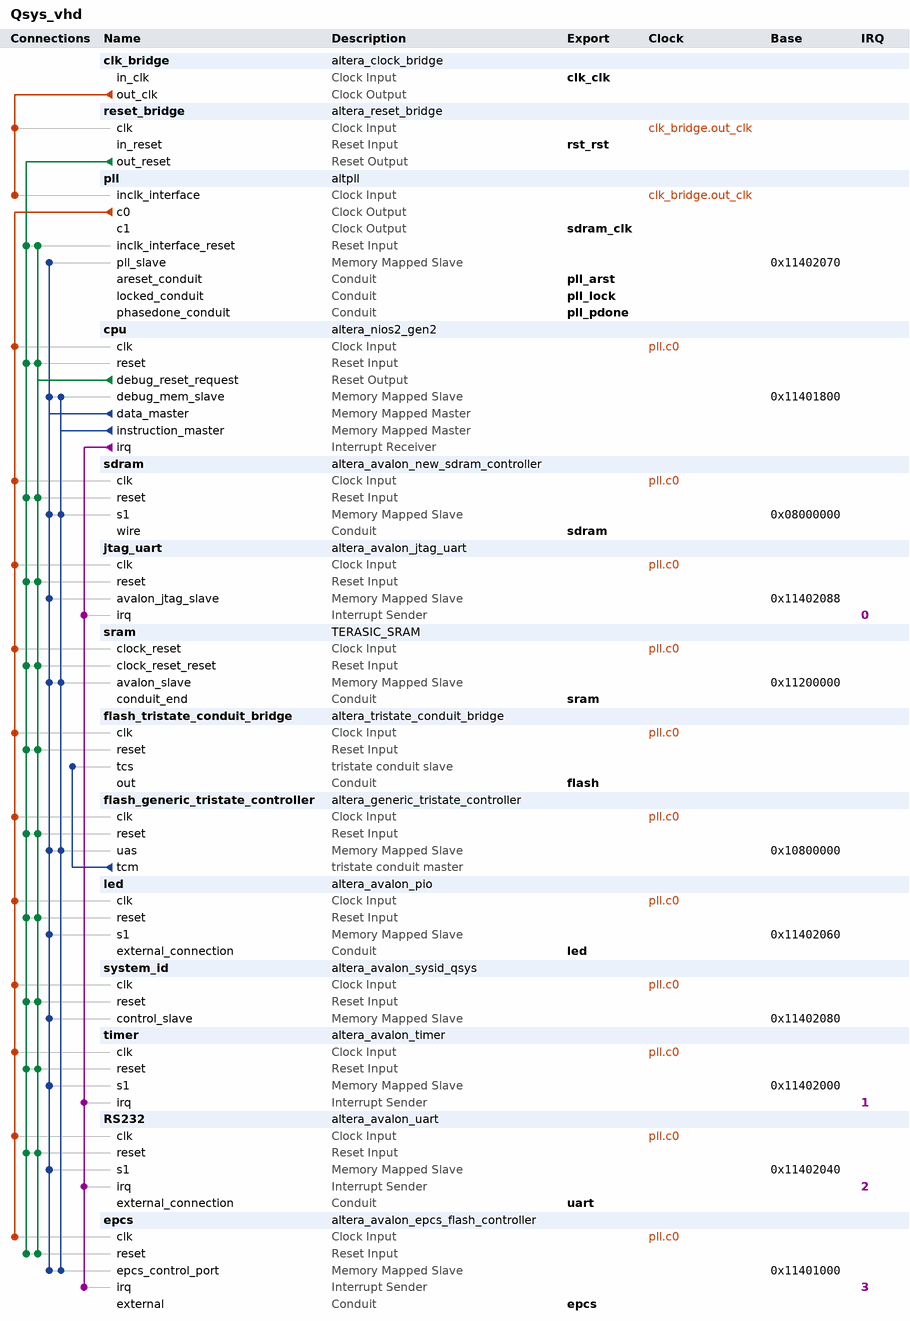
[diagram p0: system contents]
# Platform Designer (Qsys) system Qsys_vhd, Cyclone IV E EP4CE115F29C7
# Parameters at their usual value, and those the tool derives, are not listed.
package require -exact qsys 15.0
create_system Qsys_vhd
set_project_property DEVICE_FAMILY {Cyclone IV E}
set_project_property DEVICE EP4CE115F29C7

add_instance clk_bridge altera_clock_bridge 15.0
set_instance_parameter_value clk_bridge DERIVED_CLOCK_RATE 0
set_instance_parameter_value clk_bridge EXPLICIT_CLOCK_RATE 0

add_instance reset_bridge altera_reset_bridge 15.0
set_instance_parameter_value reset_bridge ACTIVE_LOW_RESET 1
set_instance_parameter_value reset_bridge SYNCHRONOUS_EDGES deassert

add_instance pll altpll 15.0
set_instance_parameter_value pll CLK0_DIVIDE_BY 1
set_instance_parameter_value pll CLK0_MULTIPLY_BY 2
set_instance_parameter_value pll CLK1_DIVIDE_BY 1
set_instance_parameter_value pll CLK1_DUTY_CYCLE 50
set_instance_parameter_value pll CLK1_MULTIPLY_BY 2
set_instance_parameter_value pll CLK1_PHASE_SHIFT -1806
set_instance_parameter_value pll CLK2_DIVIDE_BY 5
set_instance_parameter_value pll CLK2_DUTY_CYCLE 50
set_instance_parameter_value pll CLK2_MULTIPLY_BY 1
set_instance_parameter_value pll CLK2_PHASE_SHIFT 0
set_instance_parameter_value pll INCLK0_INPUT_FREQUENCY 20000
set_instance_parameter_value pll PORT_ARESET PORT_UNUSED
set_instance_parameter_value pll PORT_LOCKED PORT_UNUSED
set_instance_parameter_value pll PORT_clk1 PORT_USED
set_instance_parameter_value pll PORT_clk2 PORT_USED
set_instance_parameter_value pll PORT_clk3 PORT_UNUSED

add_instance cpu altera_nios2_gen2 15.0
set_instance_parameter_value cpu dcache_size 2048
set_instance_parameter_value cpu exceptionSlave sdram.s1
set_instance_parameter_value cpu icache_size 4096
set_instance_parameter_value cpu impl Fast
set_instance_parameter_value cpu mmu_TLBMissExcSlave sram.avalon_slave
set_instance_parameter_value cpu mul_64_impl 1
set_instance_parameter_value cpu resetSlave epcs.epcs_control_port

add_instance sdram altera_avalon_new_sdram_controller 15.0
set_instance_parameter_value sdram TAC 5.5
set_instance_parameter_value sdram TRCD 20.0
set_instance_parameter_value sdram TRP 20.0
set_instance_parameter_value sdram casLatency 3
set_instance_parameter_value sdram columnWidth 10
set_instance_parameter_value sdram dataWidth 32
set_instance_parameter_value sdram generateSimulationModel false
set_instance_parameter_value sdram model single_Micron_MT48LC4M32B2_7_chip
set_instance_parameter_value sdram numberOfBanks 4
set_instance_parameter_value sdram numberOfChipSelects 1
set_instance_parameter_value sdram powerUpDelay 100.0
set_instance_parameter_value sdram refreshPeriod 15.625
set_instance_parameter_value sdram rowWidth 13

add_instance jtag_uart altera_avalon_jtag_uart 15.0
set_instance_parameter_value jtag_uart readBufferDepth 256
set_instance_parameter_value jtag_uart simInteractiveOptions NO_INTERACTIVE_WINDOWS
set_instance_parameter_value jtag_uart writeBufferDepth 256

add_instance sram TERASIC_SRAM 1.0
set_instance_parameter_value sram ADDR_BITS 20
set_instance_parameter_value sram DATA_BITS 16

add_instance flash_tristate_conduit_bridge altera_tristate_conduit_bridge 15.0

add_instance flash_generic_tristate_controller altera_generic_tristate_controller 15.0
set_instance_parameter_value flash_generic_tristate_controller ACTIVE_LOW_BEGINTRANSFER 0
set_instance_parameter_value flash_generic_tristate_controller ACTIVE_LOW_BYTEENABLE 0
set_instance_parameter_value flash_generic_tristate_controller ACTIVE_LOW_OUTPUTENABLE 0
set_instance_parameter_value flash_generic_tristate_controller ACTIVE_LOW_READ 1
set_instance_parameter_value flash_generic_tristate_controller CHIPSELECT_THROUGH_READLATENCY 0
set_instance_parameter_value flash_generic_tristate_controller INTERFACE_ASSIGNMENT_KEYS embeddedsw.configuration.isFlash,embeddedsw.configuration.isMemoryDevice,embeddedsw.configuration.isNonVolatileStorage
set_instance_parameter_value flash_generic_tristate_controller INTERFACE_ASSIGNMENT_VALUES 1,1,1
set_instance_parameter_value flash_generic_tristate_controller MODULE_ASSIGNMENT_KEYS embeddedsw.configuration.hwClassnameDriverSupportList,embeddedsw.configuration.hwClassnameDriverSupportDefault,embeddedsw.CMacro.SETUP_VALUE,embeddedsw.CMacro.WAIT_VALUE,embeddedsw.CMacro.HOLD_VALUE,embeddedsw.CMacro.TIMING_UNITS,embeddedsw.CMacro.SIZE,embeddedsw.memoryInfo.MEM_INIT_DATA_WIDTH,embeddedsw.memoryInfo.HAS_BYTE_LANE,embeddedsw.memoryInfo.IS_FLASH,embeddedsw.memoryInfo.GENERATE_DAT_SYM,embeddedsw.memoryInfo.GENERATE_FLASH,embeddedsw.memoryInfo.DAT_SYM_INSTALL_DIR,embeddedsw.memoryInfo.FLASH_INSTALL_DIR
set_instance_parameter_value flash_generic_tristate_controller MODULE_ASSIGNMENT_VALUES altera_avalon_lan91c111:altera_avalon_cfi_flash,altera_avalon_cfi_flash,60,160,60,ns,8388608u,8,0,1,1,1,SIM_DIR,APP_DIR
set_instance_parameter_value flash_generic_tristate_controller TCM_ADDRESS_W 23
set_instance_parameter_value flash_generic_tristate_controller TCM_BYTEENABLE_W 1
set_instance_parameter_value flash_generic_tristate_controller TCM_DATA_HOLD 60
set_instance_parameter_value flash_generic_tristate_controller TCM_DATA_W 8
set_instance_parameter_value flash_generic_tristate_controller TCM_MAX_PENDING_READ_TRANSACTIONS 3
set_instance_parameter_value flash_generic_tristate_controller TCM_READLATENCY 2
set_instance_parameter_value flash_generic_tristate_controller TCM_READ_WAIT 160
set_instance_parameter_value flash_generic_tristate_controller TCM_SETUP_WAIT 60
set_instance_parameter_value flash_generic_tristate_controller TCM_SYMBOLS_PER_WORD 1
set_instance_parameter_value flash_generic_tristate_controller TCM_TIMING_UNITS 0
set_instance_parameter_value flash_generic_tristate_controller TCM_TURNAROUND_TIME 2
set_instance_parameter_value flash_generic_tristate_controller TCM_WRITE_WAIT 160
set_instance_parameter_value flash_generic_tristate_controller USE_BEGINTRANSFER 0
set_instance_parameter_value flash_generic_tristate_controller USE_BYTEENABLE 0
set_instance_parameter_value flash_generic_tristate_controller USE_OUTPUTENABLE 0
set_instance_parameter_value flash_generic_tristate_controller USE_READ 1

add_instance led altera_avalon_pio 15.0
set_instance_parameter_value led direction Output
set_instance_parameter_value led width 18

add_instance system_id altera_avalon_sysid_qsys 15.0
set_instance_parameter_value system_id id 1

add_instance timer altera_avalon_timer 15.0
set_instance_parameter_value timer counterSize 64
set_instance_parameter_value timer period 1
set_instance_parameter_value timer periodUnits MSEC

add_instance RS232 altera_avalon_uart 15.0
set_instance_parameter_value RS232 baud 115200
set_instance_parameter_value RS232 dataBits 8
set_instance_parameter_value RS232 fixedBaud true
set_instance_parameter_value RS232 parity NONE
set_instance_parameter_value RS232 stopBits 1
set_instance_parameter_value RS232 useCtsRts true
set_instance_parameter_value RS232 useEopRegister true

add_instance epcs altera_avalon_epcs_flash_controller 15.0
set_instance_parameter_value epcs resetrequest_enabled true

# connections
add_connection clk_bridge.out_clk pll.inclk_interface clock
add_connection clk_bridge.out_clk reset_bridge.clk clock
add_connection pll.c0 cpu.clk clock
add_connection pll.c0 epcs.clk clock
add_connection pll.c0 flash_generic_tristate_controller.clk clock
add_connection pll.c0 flash_tristate_conduit_bridge.clk clock
add_connection pll.c0 jtag_uart.clk clock
add_connection pll.c0 led.clk clock
add_connection pll.c0 RS232.clk clock
add_connection pll.c0 sdram.clk clock
add_connection pll.c0 sram.clock_reset clock
add_connection pll.c0 system_id.clk clock
add_connection pll.c0 timer.clk clock
add_connection cpu.debug_reset_request cpu.reset reset
add_connection cpu.debug_reset_request epcs.reset reset
add_connection cpu.debug_reset_request flash_generic_tristate_controller.reset reset
add_connection cpu.debug_reset_request flash_tristate_conduit_bridge.reset reset
add_connection cpu.debug_reset_request jtag_uart.reset reset
add_connection cpu.debug_reset_request led.reset reset
add_connection cpu.debug_reset_request pll.inclk_interface_reset reset
add_connection cpu.debug_reset_request RS232.reset reset
add_connection cpu.debug_reset_request sdram.reset reset
add_connection cpu.debug_reset_request sram.clock_reset_reset reset
add_connection cpu.debug_reset_request system_id.reset reset
add_connection cpu.debug_reset_request timer.reset reset
add_connection reset_bridge.out_reset cpu.reset reset
add_connection reset_bridge.out_reset epcs.reset reset
add_connection reset_bridge.out_reset flash_generic_tristate_controller.reset reset
add_connection reset_bridge.out_reset flash_tristate_conduit_bridge.reset reset
add_connection reset_bridge.out_reset jtag_uart.reset reset
add_connection reset_bridge.out_reset led.reset reset
add_connection reset_bridge.out_reset pll.inclk_interface_reset reset
add_connection reset_bridge.out_reset RS232.reset reset
add_connection reset_bridge.out_reset sdram.reset reset
add_connection reset_bridge.out_reset sram.clock_reset_reset reset
add_connection reset_bridge.out_reset system_id.reset reset
add_connection reset_bridge.out_reset timer.reset reset
add_connection cpu.data_master cpu.debug_mem_slave avalon
set_connection_parameter_value cpu.data_master/cpu.debug_mem_slave baseAddress 0x11401800
add_connection cpu.data_master epcs.epcs_control_port avalon
set_connection_parameter_value cpu.data_master/epcs.epcs_control_port baseAddress 0x11401000
add_connection cpu.data_master flash_generic_tristate_controller.uas avalon
set_connection_parameter_value cpu.data_master/flash_generic_tristate_controller.uas baseAddress 0x10800000
add_connection cpu.data_master jtag_uart.avalon_jtag_slave avalon
set_connection_parameter_value cpu.data_master/jtag_uart.avalon_jtag_slave baseAddress 0x11402088
add_connection cpu.data_master led.s1 avalon
set_connection_parameter_value cpu.data_master/led.s1 baseAddress 0x11402060
add_connection cpu.data_master pll.pll_slave avalon
set_connection_parameter_value cpu.data_master/pll.pll_slave baseAddress 0x11402070
add_connection cpu.data_master RS232.s1 avalon
set_connection_parameter_value cpu.data_master/RS232.s1 baseAddress 0x11402040
add_connection cpu.data_master sdram.s1 avalon
set_connection_parameter_value cpu.data_master/sdram.s1 baseAddress 0x08000000
add_connection cpu.data_master sram.avalon_slave avalon
set_connection_parameter_value cpu.data_master/sram.avalon_slave baseAddress 0x11200000
add_connection cpu.data_master system_id.control_slave avalon
set_connection_parameter_value cpu.data_master/system_id.control_slave baseAddress 0x11402080
add_connection cpu.data_master timer.s1 avalon
set_connection_parameter_value cpu.data_master/timer.s1 baseAddress 0x11402000
add_connection cpu.instruction_master cpu.debug_mem_slave avalon
set_connection_parameter_value cpu.instruction_master/cpu.debug_mem_slave baseAddress 0x11401800
add_connection cpu.instruction_master epcs.epcs_control_port avalon
set_connection_parameter_value cpu.instruction_master/epcs.epcs_control_port baseAddress 0x11401000
add_connection cpu.instruction_master flash_generic_tristate_controller.uas avalon
set_connection_parameter_value cpu.instruction_master/flash_generic_tristate_controller.uas baseAddress 0x10800000
add_connection cpu.instruction_master sdram.s1 avalon
set_connection_parameter_value cpu.instruction_master/sdram.s1 baseAddress 0x08000000
add_connection cpu.instruction_master sram.avalon_slave avalon
set_connection_parameter_value cpu.instruction_master/sram.avalon_slave baseAddress 0x11200000
add_connection cpu.irq epcs.irq interrupt
set_connection_parameter_value cpu.irq/epcs.irq irqNumber 3
add_connection cpu.irq jtag_uart.irq interrupt
set_connection_parameter_value cpu.irq/jtag_uart.irq irqNumber 0
add_connection cpu.irq RS232.irq interrupt
set_connection_parameter_value cpu.irq/RS232.irq irqNumber 2
add_connection cpu.irq timer.irq interrupt
set_connection_parameter_value cpu.irq/timer.irq irqNumber 1
add_connection flash_generic_tristate_controller.tcm flash_tristate_conduit_bridge.tcs tristate_conduit

# exported interfaces
add_interface clk_clk clock sink
set_interface_property clk_clk EXPORT_OF clk_bridge.in_clk
add_interface epcs conduit end
set_interface_property epcs EXPORT_OF epcs.external
add_interface flash conduit end
set_interface_property flash EXPORT_OF flash_tristate_conduit_bridge.out
add_interface led conduit end
set_interface_property led EXPORT_OF led.external_connection
add_interface pll_arst conduit end
set_interface_property pll_arst EXPORT_OF pll.areset_conduit
add_interface pll_lock conduit end
set_interface_property pll_lock EXPORT_OF pll.locked_conduit
add_interface pll_pdone conduit end
set_interface_property pll_pdone EXPORT_OF pll.phasedone_conduit
add_interface rst_rst reset sink
set_interface_property rst_rst EXPORT_OF reset_bridge.in_reset
add_interface sdram conduit end
set_interface_property sdram EXPORT_OF sdram.wire
add_interface sdram_clk clock source
set_interface_property sdram_clk EXPORT_OF pll.c1
add_interface sram conduit end
set_interface_property sram EXPORT_OF sram.conduit_end
add_interface uart conduit end
set_interface_property uart EXPORT_OF RS232.external_connection

set_interconnect_requirement {$system} qsys_mm.clockCrossingAdapter HANDSHAKE
set_interconnect_requirement {$system} qsys_mm.enableEccProtection FALSE
set_interconnect_requirement {$system} qsys_mm.insertDefaultSlave FALSE
set_interconnect_requirement {$system} qsys_mm.maxAdditionalLatency 1

save_system Qsys_vhd.qsys
